# EAGLE schematic radio-v4.0 (EAGLE 9.5.2)
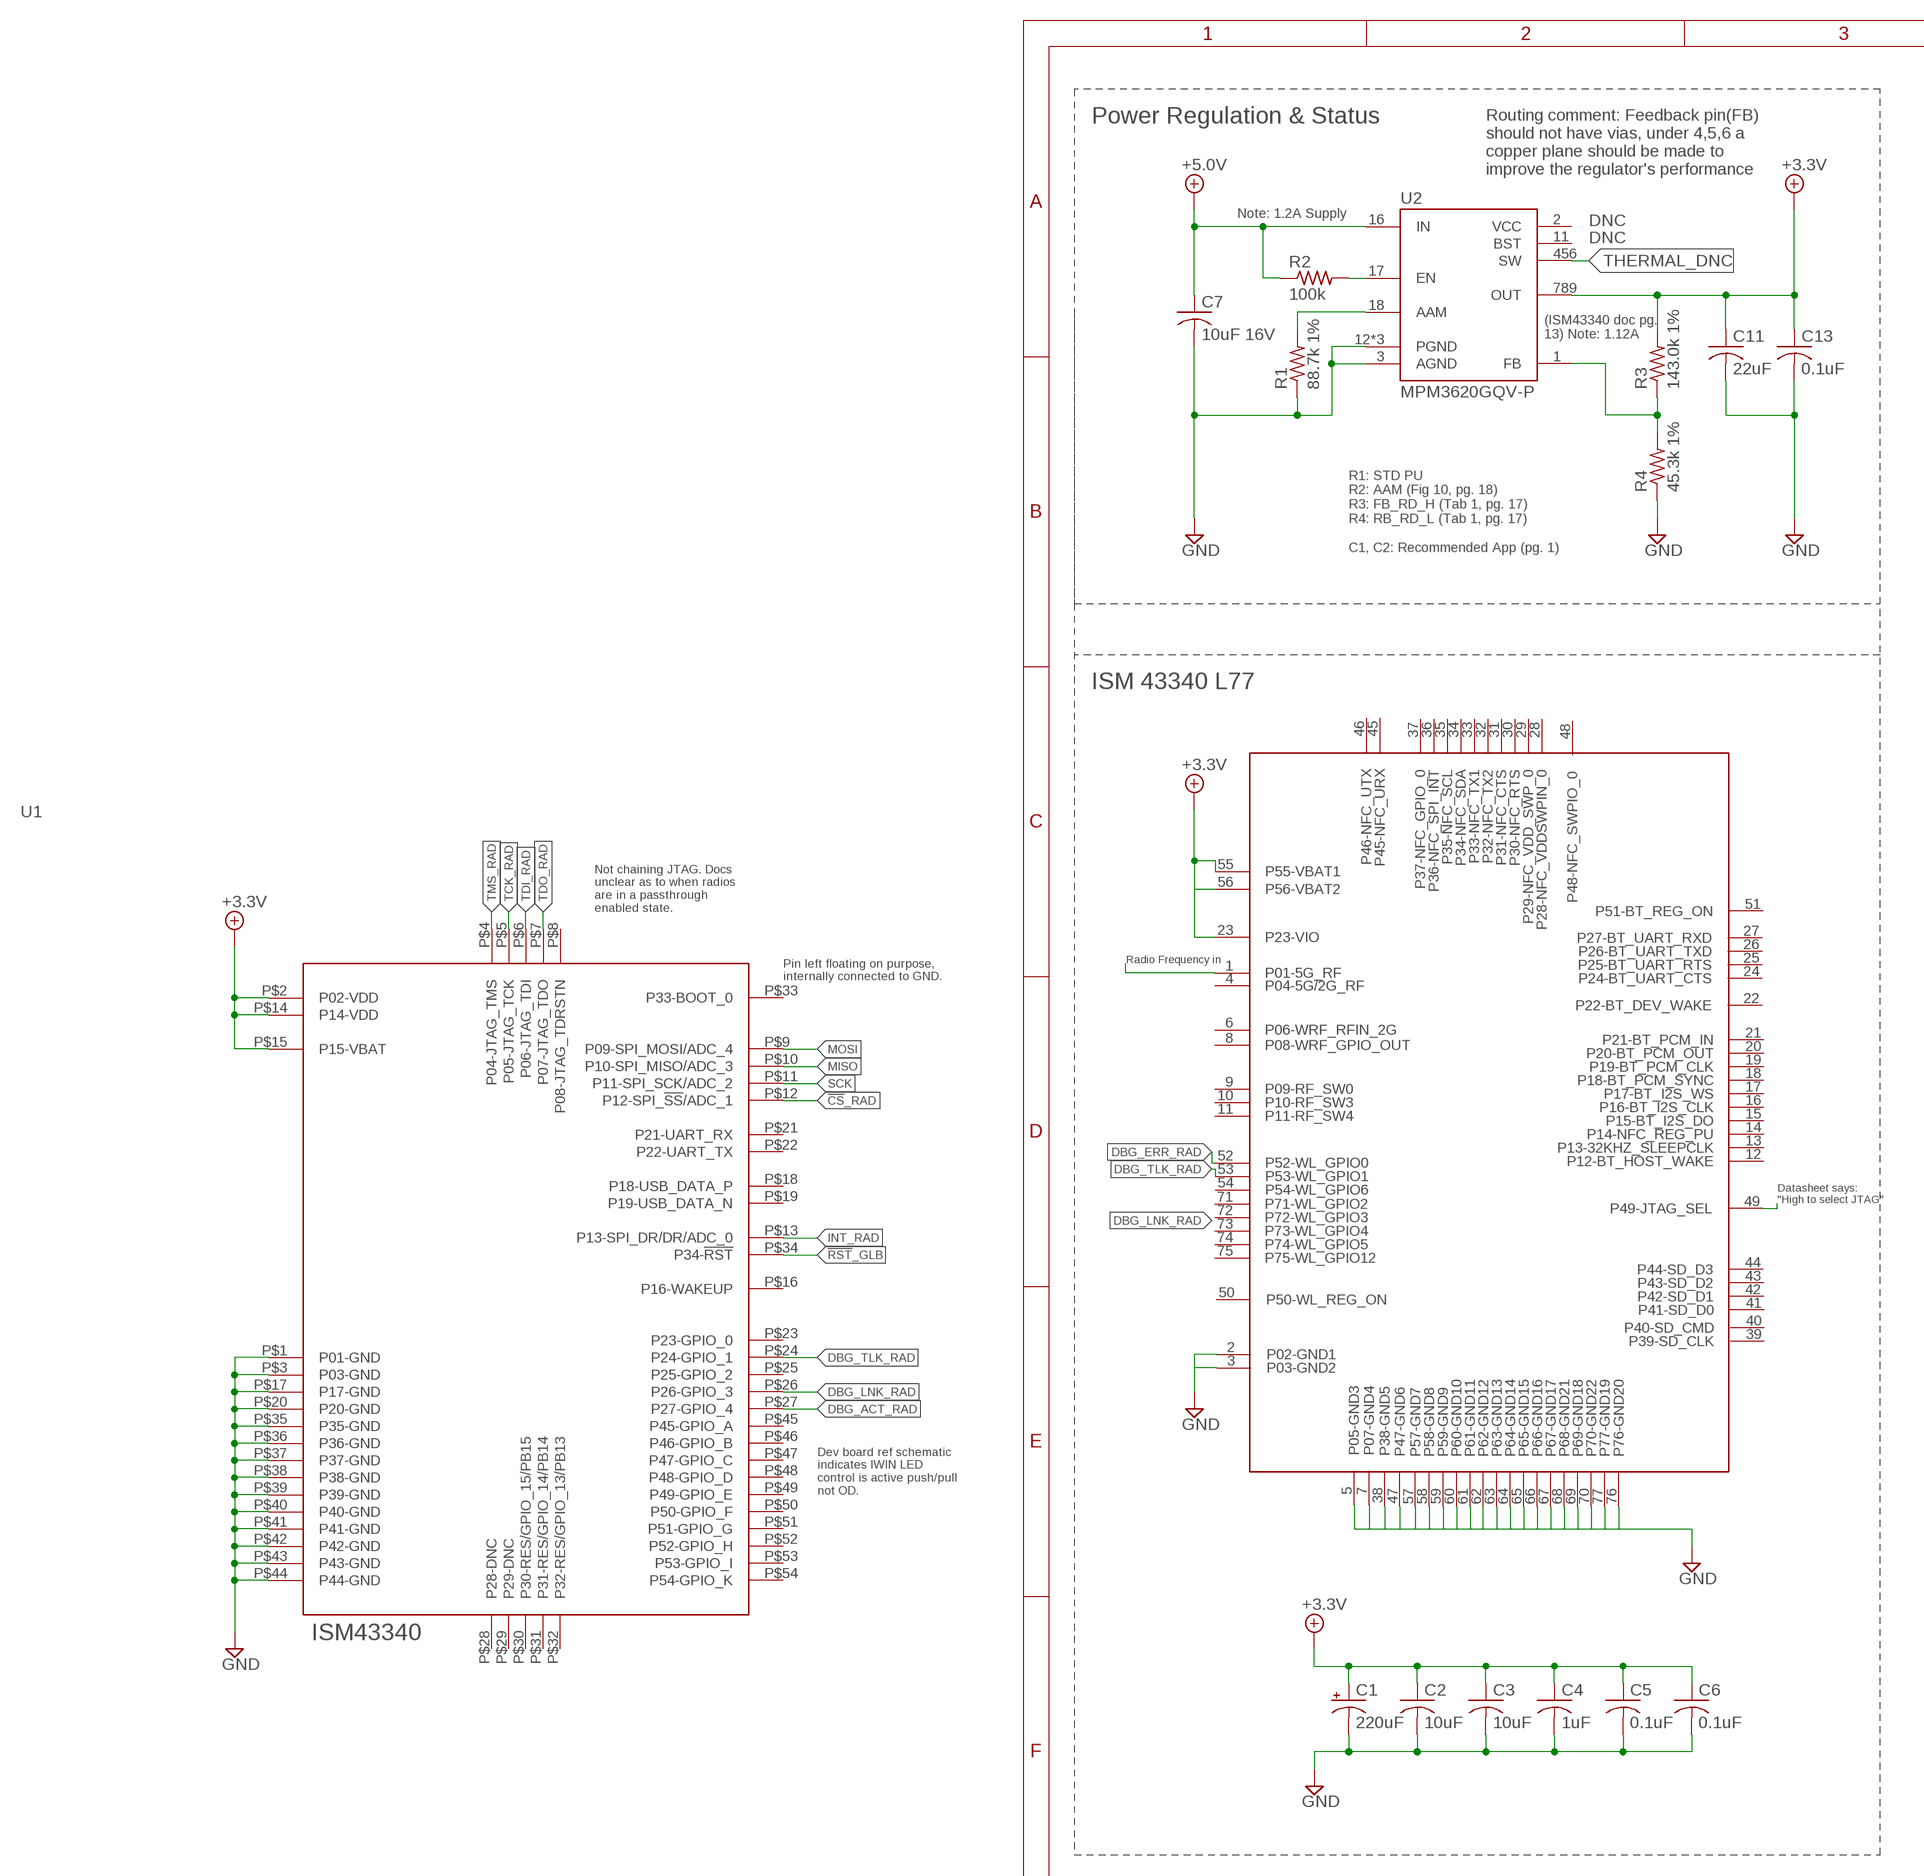
[diagram p0: schematic, sheet 1, part 1 of 2]
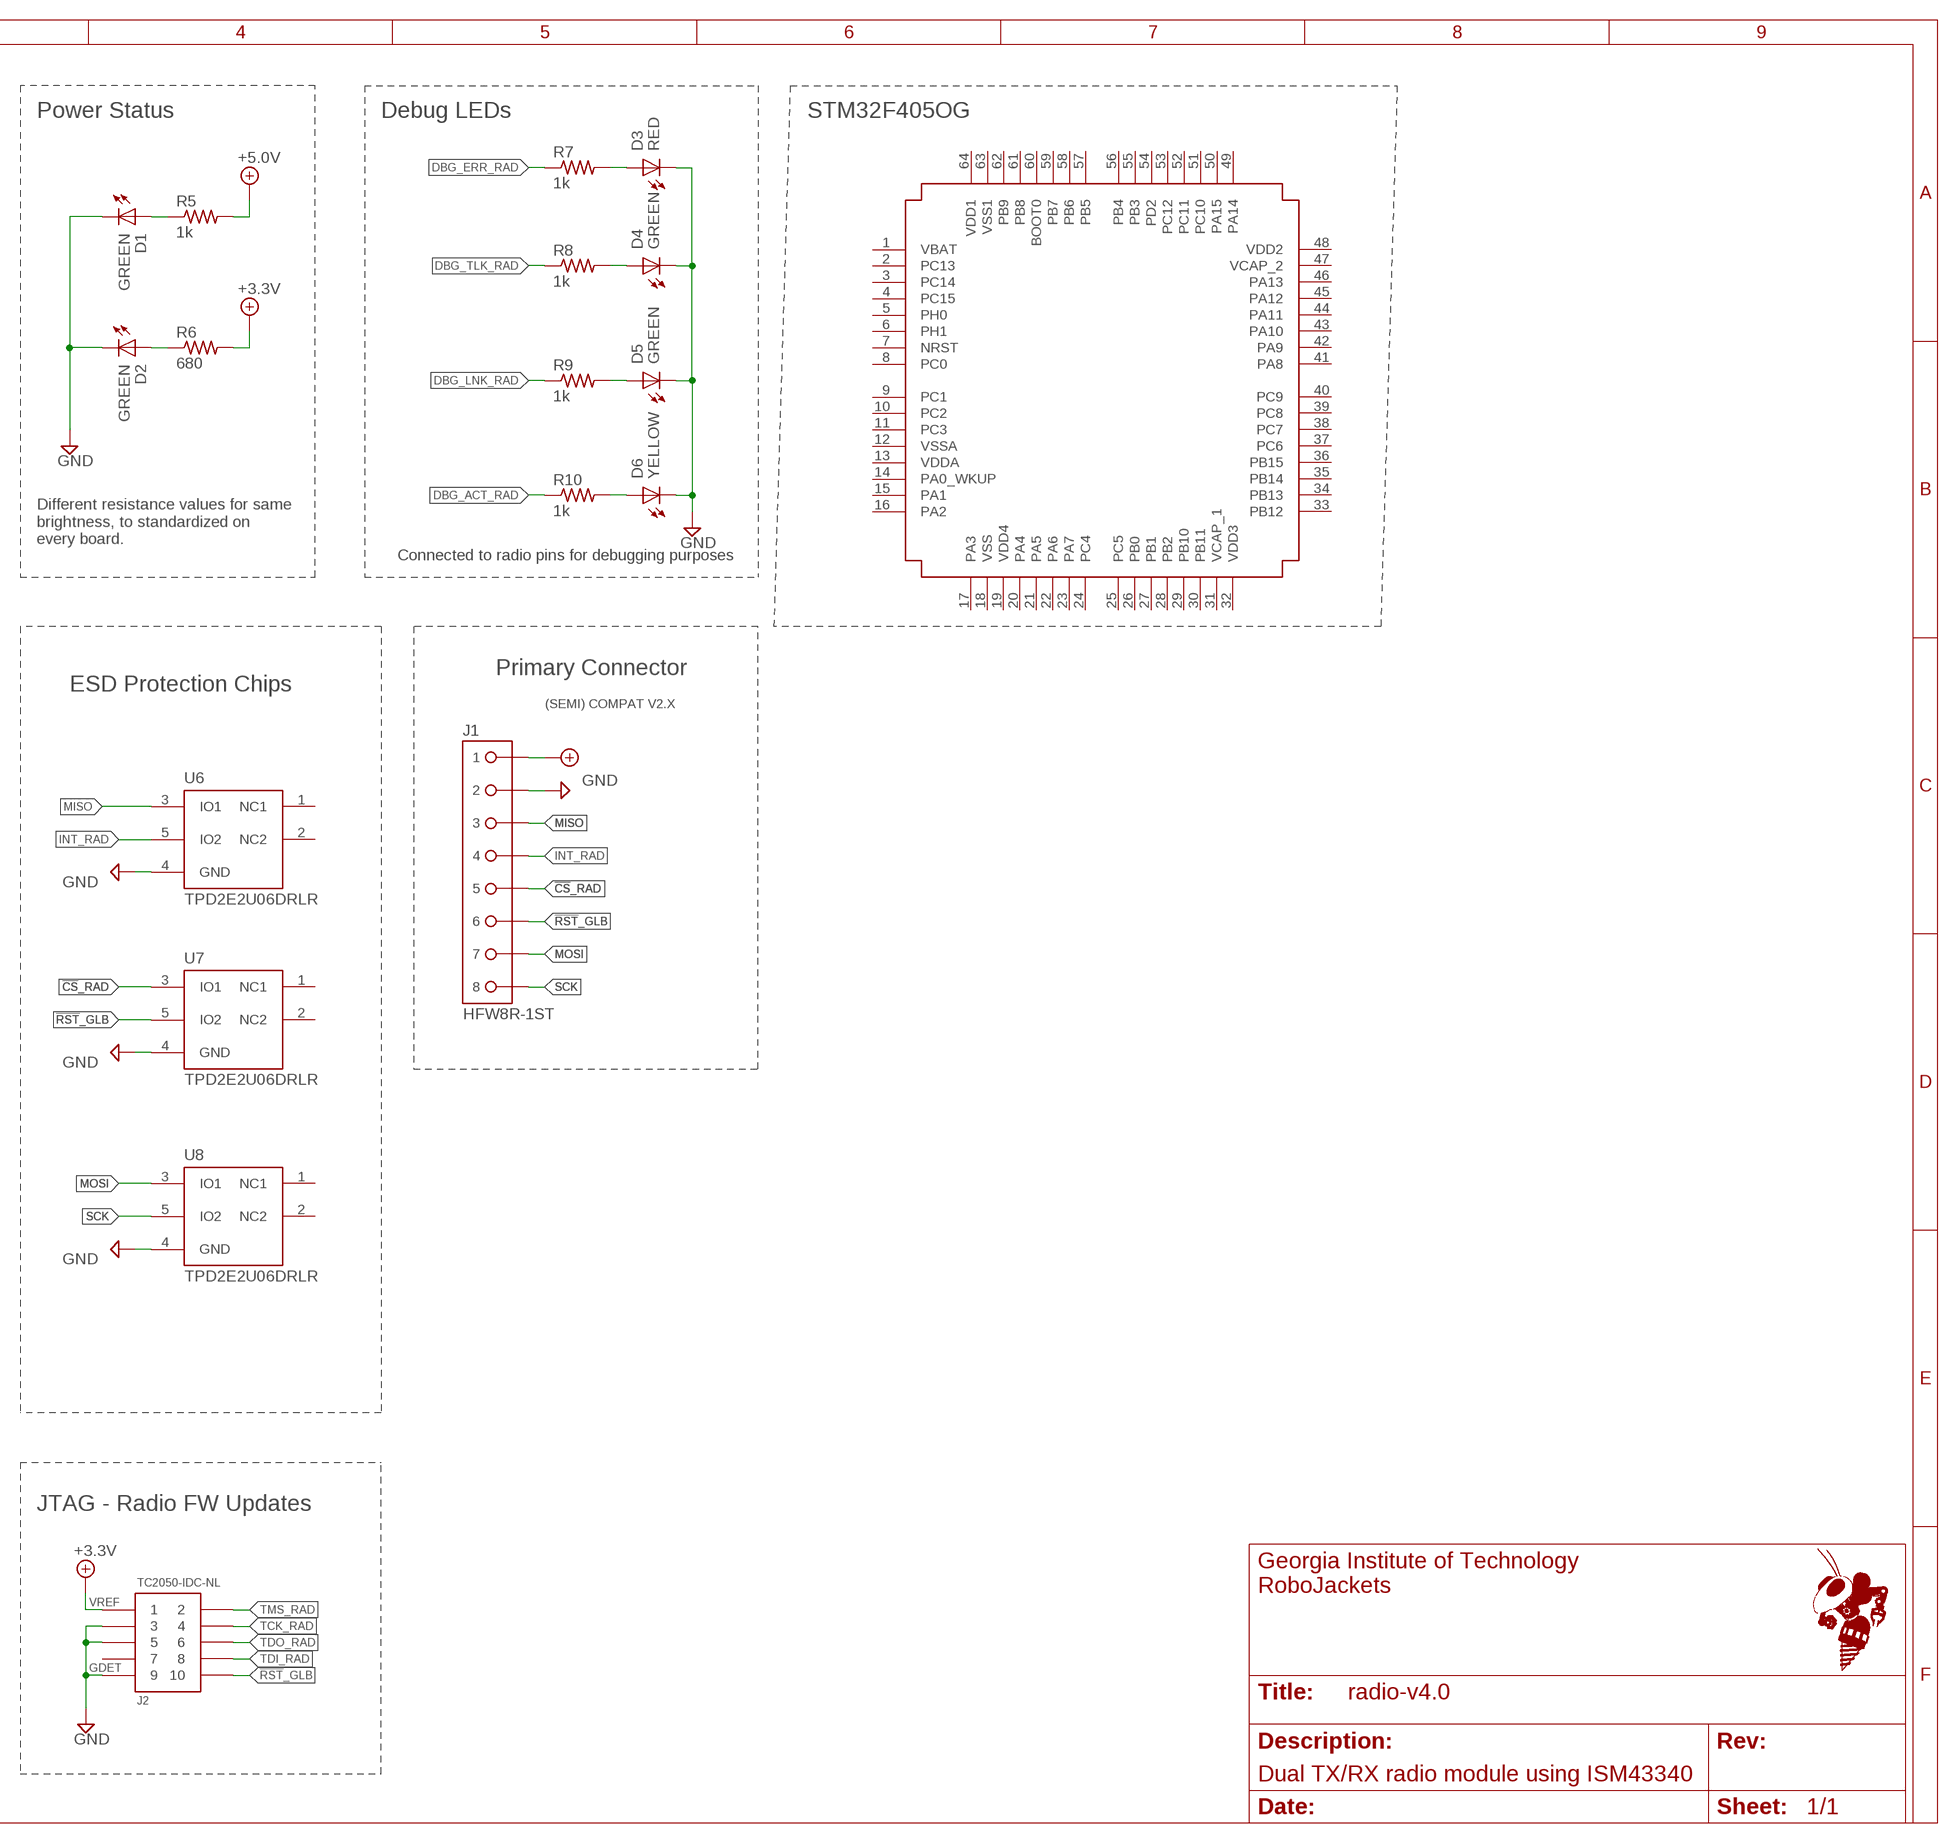
[diagram p1: schematic, sheet 1, part 2 of 2]
FRAME1 (FRAME_B_L): SCH_DESC: Dual TX/RX radio module using ISM43340

## Parts
C1  220uF  ECA-0JM221  [ECA-0JM221-HGT_HORIZ]
C2  10uF  C-USC0805  [C0805]
C3  10uF  C-USC0805  [C0805]
C4  1uF  C-USC0603  [C0603]
C5  0.1uF  C-USC0603  [C0603]
C6  0.1uF  C-USC0603  [C0603]
C7  10uF 16V  C-USC1210  [C1210]
C11  22uF  C-USC1210  [C1210]
C13  0.1uF  C-USC0603  [C0603]
D1  GREEN  LED-SMD-GREEN  [CHIP-LED0603]
D2  GREEN  LED-SMD-GREEN  [CHIP-LED0603]
D3  RED  LED-SMD-RED  [CHIP-LED0603]
D4  GREEN  LED-SMD-GREEN  [CHIP-LED0603]
D5  GREEN  LED-SMD-GREEN  [CHIP-LED0603]
D6  YELLOW  LED-SMD-YELLOW  [CHIP-LED0603]
J1  HFW8R-1ST  [HFW8R-1ST]
J2  TC2050-IDC-NL  [TC2050-IDC-NL]
R1  88.7k 1%  R-US_R0603  [R0603]
R2  100k  R-US_R0603  [R0603]
R3  143.0k 1%  R-US_R0603  [R0603]
R4  45.3k 1%  R-US_R0603  [R0603]
R5  1k  R-US_R0603  [R0603]
R6  680  R-US_R0603  [R0603]
R7  1k  R-US_R0603  [R0603]
R8  1k  R-US_R0603  [R0603]
R9  1k  R-US_R0603  [R0603]
R10  1k  R-US_R0603  [R0603]
U1  ISM43340  [ISM43340]
U2  MPM3620GQV-P  [MPM3620GQV-P]
U6  TPD2E2U06DRLR  [SOT-553]
U7  TPD2E2U06DRLR  [SOT-553]
U8  TPD2E2U06DRLR  [SOT-553]
U$1  ISM43340-L77  [ISM43340-L77]
U$2  STM32F405OG-LQFP64  [STM32F405OG-LQFP64]

## Nets
3V3_PWR_IND: D2.A R6.1
5V_PWR_IND: D1.A R5.1
!CS!_RAD: J1.5 U1.P$12(P12-SPI_!SS!/ADC_1) U7.3(IO1)
!RST!_GLB: J1.6 J2.10 U1.P$34(P34-!RST!) U7.5(IO2)
+3.3V: C1.P$1(+) C2.1 C3.1 C4.1 C5.1 C6.1 C11.1 C13.1 J2.1 R3.2 R6.2 U1.P$2(P02-VDD) U1.P$14(P14-VDD) U1.P$15(P15-VBAT) U2.789(OUT) U$1.23(P23-VIO) U$1.55(P55-VBAT1) U$1.56(P56-VBAT2)
+5.0V: C7.1 J1.1 R2.1 R5.2 U2.16(IN)
AAM: R1.2 U2.18(AAM)
DBG_ACT_RAD: R10.1 U1.P$27(P27-GPIO_4)
DBG_ERR: D3.A R7.2
DBG_ERR_RAD: R7.1 U$1.52(P52-WL_GPIO0)
DBG_LNK_RAD: R9.1 U1.P$26(P26-GPIO_3)
DBG_TLK_RAD: R8.1 U1.P$24(P24-GPIO_1)
DGB_ACT: D6.A R10.2
DGB_LNK: D5.A R9.2
EN: R2.2 U2.17(EN)
FB: R3.1 R4.2 U2.1(FB)
GND: C1.P$2(-) C2.2 C3.2 C4.2 C5.2 C6.2 C7.2 C11.2 C13.2 D1.C(K) D2.C(K) D3.C(K) D4.C(K) D5.C(K) D6.C(K) J1.2 J2.3 J2.5 J2.9 R1.1 R4.1 U1.P$1(P01-GND) U1.P$3(P03-GND) U1.P$17(P17-GND) U1.P$20(P20-GND) U1.P$35(P35-GND) U1.P$36(P36-GND) U1.P$37(P37-GND) U1.P$38(P38-GND) U1.P$39(P39-GND) U1.P$40(P40-GND) U1.P$41(P41-GND) U1.P$42(P42-GND) U1.P$43(P43-GND) U1.P$44(P44-GND) U2.3(AGND) U2.12(PGND) U2.13(PGND) U2.14(PGND) U6.4(GND) U7.4(GND) U8.4(GND) U$1.2(P02-GND1) U$1.3(P03-GND2) U$1.76(P76-GND20) U$1.77(P77-GND19)
INT_RAD: J1.4 U1.P$13(P13-SPI_DR/DR/ADC_0) U6.5(IO2)
MISO: J1.3 U1.P$10(P10-SPI_MISO/ADC_3) U6.3(IO1)
MOSI: J1.7 U1.P$9(P09-SPI_MOSI/ADC_4) U8.3(IO1)
N$1: U$1.5(P05-GND3) U$1.7(P07-GND4) U$1.38(P38-GND5) U$1.47(P47-GND6) U$1.57(P57-GND7) U$1.58(P58-GND8) U$1.59(P59-GND9) U$1.60(P60-GND10) U$1.61(P61-GND11) U$1.62(P62-GND12) U$1.63(P63-GND13) U$1.64(P64-GND14) U$1.65(P65-GND15) U$1.66(P66-GND16) U$1.67(P67-GND17) U$1.68(P68-GND21) U$1.69(P69-GND18) U$1.70(P70-GND22)
N$2: U$1.53(P53-WL_GPIO1)
N$3: U$1.49(P49-JTAG_SEL)
N$4: U$1.1(P01-5G_RF)
SCK: J1.8 U1.P$11(P11-SPI_SCK/ADC_2) U8.5(IO2)
TCK_RAD: J2.4 U1.P$5(P05-JTAG_TCK)
TDI_RAD: J2.8 U1.P$6(P06-JTAG_TDI)
TDO_RAD: J2.6 U1.P$7(P07-JTAG_TDO)
THERMAL_DNC: U2.456(SW)
TLK: D4.A R8.2
TMS_RAD: J2.2 U1.P$4(P04-JTAG_TMS)
Unconnected: J1.LEG1 J1.LEG2 J2.7 U1.P$8(P08-JTAG_TDRSTN) U1.P$16(P16-WAKEUP) U1.P$18(P18-USB_DATA_P) U1.P$19(P19-USB_DATA_N) U1.P$21(P21-UART_RX) U1.P$22(P22-UART_TX) U1.P$23(P23-GPIO_0) U1.P$25(P25-GPIO_2) U1.P$28(P28-DNC) U1.P$29(P29-DNC) U1.P$30(P30-RES/GPIO_15/PB15) U1.P$31(P31-RES/GPIO_14/PB14) U1.P$32(P32-RES/GPIO_13/PB13) U1.P$33(P33-BOOT_0) U1.P$45(P45-GPIO_A) U1.P$46(P46-GPIO_B) U1.P$47(P47-GPIO_C) U1.P$48(P48-GPIO_D) U1.P$49(P49-GPIO_E) U1.P$50(P50-GPIO_F) U1.P$51(P51-GPIO_G) U1.P$52(P52-GPIO_H) U1.P$53(P53-GPIO_I) U1.P$54(P54-GPIO_K) U2.2(VCC) U2.11(BST) U6.1(NC1) U6.2(NC2) U7.1(NC1) U7.2(NC2) U8.1(NC1) U8.2(NC2) U$1.4(P04-5G/2G_RF) U$1.6(P06-WRF_RFIN_2G) U$1.8(P08-WRF_GPIO_OUT) U$1.9(P09-RF_SW0) U$1.10(P10-RF_SW3) U$1.11(P11-RF_SW4) U$1.12(P12-BT_HOST_WAKE) U$1.13(P13-32KHZ_SLEEPCLK) U$1.14(P14-NFC_REG_PU) U$1.15(P15-BT_I2S_DO) U$1.16(P16-BT_I2S_CLK) U$1.17(P17-BT_I2S_WS) U$1.18(P18-BT_PCM_SYNC) U$1.19(P19-BT_PCM_CLK) U$1.20(P20-BT_PCM_OUT) U$1.21(P21-BT_PCM_IN) U$1.22(P22-BT_DEV_WAKE) U$1.24(P24-BT_UART_CTS) U$1.25(P25-BT_UART_RTS) U$1.26(P26-BT_UART_TXD) U$1.27(P27-BT_UART_RXD) U$1.28(P28-NFC_VDDSWPIN_0) U$1.29(P29-NFC_VDD_SWP_0) U$1.30(P30-NFC_RTS) U$1.31(P31-NFC_CTS) U$1.32(P32-NFC_TX2) U$1.33(P33-NFC_TX1) U$1.34(P34-NFC_SDA) U$1.35(P35-NFC_SCL) U$1.36(P36-NFC_SPI_INT) U$1.37(P37-NFC_GPIO_0) U$1.39(P39-SD_CLK) U$1.40(P40-SD_CMD) U$1.41(P41-SD_D0) U$1.42(P42-SD_D1) U$1.43(P43-SD_D2) U$1.44(P44-SD_D3) U$1.45(P45-NFC_URX) U$1.46(P46-NFC_UTX) U$1.48(P48-NFC_SWPIO_0) U$1.50(P50-WL_REG_ON) U$1.51(P51-BT_REG_ON) U$1.54(P54-WL_GPIO6) U$1.71(P71-WL_GPIO2) U$1.72(P72-WL_GPIO3) U$1.73(P73-WL_GPIO4) U$1.74(P74-WL_GPIO5) U$1.75(P75-WL_GPIO12) U$2.1(VBAT) U$2.2(PC13) U$2.3(PC14) U$2.4(PC15) U$2.5(PH0) U$2.6(PH1) U$2.7(NRST) U$2.8(PC0) U$2.9(PC1) U$2.10(PC2) U$2.11(PC3) U$2.12(VSSA) U$2.13(VDDA) U$2.14(PA0_WKUP) U$2.15(PA1) U$2.16(PA2) U$2.17(PA3) U$2.18(VSS) U$2.19(VDD4) U$2.20(PA4) U$2.21(PA5) U$2.22(PA6) U$2.23(PA7) U$2.24(PC4) U$2.25(PC5) U$2.26(PB0) U$2.27(PB1) U$2.28(PB2) U$2.29(PB10) U$2.30(PB11) U$2.31(VCAP_1) U$2.32(VDD3) U$2.33(PB12) U$2.34(PB13) U$2.35(PB14) U$2.36(PB15) U$2.37(PC6) U$2.38(PC7) U$2.39(PC8) U$2.40(PC9) U$2.41(PA8) U$2.42(PA9) U$2.43(PA10) U$2.44(PA11) U$2.45(PA12) U$2.46(PA13) U$2.47(VCAP_2) U$2.48(VDD2) U$2.49(PA14) U$2.50(PA15) U$2.51(PC10) U$2.52(PC11) U$2.53(PC12) U$2.54(PD2) U$2.55(PB3) U$2.56(PB4) U$2.57(PB5) U$2.58(PB6) U$2.59(PB7) U$2.60(BOOT0) U$2.61(PB8) U$2.62(PB9) U$2.63(VSS1) U$2.64(VDD1)

## Notes on the sheet
- Power Regulation & Status | Power Status | Debug LEDs | STM32F405OG
- Routing comment: Feedback pin(FB)
  should not have vias, under 4,5,6 a 
  copper plane should be made to 
  improve the regulator's performance
- Note: 1.2A Supply
- DNC
- DNC
- (ISM43340 doc pg. 
  13) Note: 1.12A
- R1: STD PU
  R2: AAM (Fig 10, pg. 18)
  R3: FB_RD_H (Tab 1, pg. 17)
  R4: RB_RD_L (Tab 1, pg. 17)
  
  C1, C2: Recommended App (pg. 1)
- Different resistance values for same
  brightness, to standardized on 
  every board.
- Connected to radio pins for debugging purposes
- ISM 43340 L77
- Primary Connector
- ESD Protection Chips
- (SEMI) COMPAT V2.X
- Not chaining JTAG. Docs 
  unclear as to when radios 
  are in a passthrough 
  enabled state.
- Radio Frequency in
- Pin left floating on purpose, 
  internally connected to GND.
- Datasheet says: 
  "High to select JTAG"
- Dev board ref schematic 
  indicates IWIN LED 
  control is active push/pull 
  not OD.
- JTAG - Radio FW Updates
- VREF
- GDET

## Library data of the parts
C1 = RoboJackets-Capacitors:ECA-0JM221
C2-C7 C11 C13 = rcl:C-US: CAPACITOR, American symbol; SPICEPREFIX: C
D1 D2 D4 D5 = RoboJackets-LEDs:LED-SMD; DIGIKEY: 160-1446-1-ND; MPN: LTST-C191KGKT
D3 = RoboJackets-LEDs:LED-SMD; DIGIKEY: 160-1447-1-ND; MPN: LTST-C191KRKT
D6 = RoboJackets-LEDs:LED-SMD; DIGIKEY: 160-1448-1-ND; MPN: LTST-C191KSKT
J1 = RoboJackets-Connectors:HFW8; DIGIKEY: 609-1788-1-ND; MPN: HFW8R-1STE1LF
J2 = RoboJackets-Connectors:TC2050-IDC-NL
R1 R2 R5-R10 = resistor:R-US_: RESISTOR, American symbol
R3 R4 = rcl:R-US_: RESISTOR, American symbol; SPICEPREFIX: R
U1 = RoboJackets-RF:ISM43340
U2 = mchair:MPM3620GQV-P
U6-U8 = radio_in_progress:TPD2E2U06DRLR
U$1 = RoboJackets-RF:ISM43340-L77: Description Part: ISM43340-L77 Datasheet: https://www.inventeksys.com/wp-content/uploads/ISM43340_Functional_Specification.pdf
U$2 = RoboJackets-RF:STM32F405OG-LQFP64